# EAGLE schematic schema test week 5 (EAGLE 9.5.1)
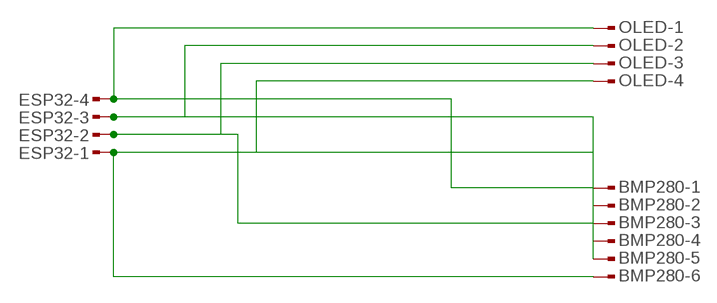
[diagram p0: schematic, sheet 1]

## Parts
BMP280  MTOP-6  [MTOP-6]
ESP32  MTOP-4  [MTOP-4]
OLED  MTOP-4  [MTOP-4]

## Nets
N$1: BMP280.1 ESP32.4 OLED.1
N$3: BMP280.2 ESP32.3 OLED.2
N$4: BMP280.3 ESP32.2 OLED.3
N$5: BMP280.4 BMP280.5 BMP280.6 ESP32.1 OLED.4

## Library data of the parts
BMP280 = con-amp:MTOP-6: AMP connector
ESP32 OLED = con-amp:MTOP-4: AMP connector